# Altium schematic sheet VT_WRP.SchDoc
size A; DocumentNumber: 4; SheetNumber: 4; SheetTotal: 13
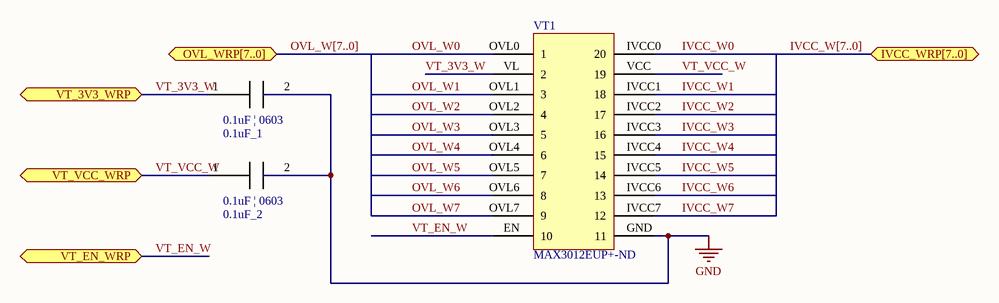
[diagram p0: VT_WRP.SchDoc]

## Parts
0.1uF_1  0.1uF_0603  [0.1uF_0603]  (value not drawn)
0.1uF_2  0.1uF_0603  [0.1uF_0603]  (value not drawn)
VT1  Supplier Part Number 1: MAX3012EUP+-ND  [VT_TSSOP20]  (hidden comment: MAX3012EUP+)

## Ports
IVCC_WRP[7..0], OVL_WRP[7..0], VT_3V3_WRP, VT_EN_WRP, VT_VCC_WRP

## Nets
GND: 0.1uF_1.2 0.1uF_2.2 VT1.GND(11)
IVCC_W0: VT1.IVCC0(20)
IVCC_W1: VT1.IVCC1(18)
IVCC_W2: VT1.IVCC2(17)
IVCC_W3: VT1.IVCC3(16)
IVCC_W4: VT1.IVCC4(15)
IVCC_W5: VT1.IVCC5(14)
IVCC_W6: VT1.IVCC6(13)
IVCC_W7: VT1.IVCC7(12)
OVL_W0: VT1.OVL0(1)
OVL_W1: VT1.OVL1(3)
OVL_W2: VT1.OVL2(4)
OVL_W3: VT1.OVL3(5)
OVL_W4: VT1.OVL4(6)
OVL_W5: VT1.OVL5(7)
OVL_W6: VT1.OVL6(8)
OVL_W7: VT1.OVL7(9)
VT_3V3_W: 0.1uF_1.1 VT1.VL(2) ; port VT_3V3_WRP
VT_EN_W: VT1.EN(10) ; port VT_EN_WRP
VT_VCC_W: 0.1uF_2.1 VT1.VCC(19) ; port VT_VCC_WRP

## Buses and harness runs
bus IVCC_W[7..0] = port IVCC_WRP[7..0]
bus OVL_W[7..0] = port OVL_WRP[7..0]

## Notes on the sheet
- (in symbol 0.1uF_0603) 0.1uF | 0603

## Library data of the parts
VT1 = MAX3012EUP+: IC TRANSLATOR LEVEL 8CH 20-TSSOP; Manufacturer: Maxim Integrated; Translator Type: Voltage Level; Channel Type: Unidirectional; Number of Circuits: 1; Channels per Circuit: 8; Voltage - VCCA: 1.2 V ~ 5.5 V; Voltage - VCCB: 1.65 V ~ 5.5 V; Output Type: Tri-State, Non-Inverted; Data Rate: 35Mbps; Supplier 1: Digi-Key; Manufacturer Part Number: MAX3012EUP+; RoHS: RoHS Compliant; Category: Integrated Circuits (ICs); Stock 1: 297; Pricing 1: 1=3.17, 10=3.012, 25=2.81, 50=2.7668 (USD); Packaging: Tube; Input Signal: -; Output Signal: -; Operating Temperature: -40°C ~ 85°C (TA); Features: Power Supply Decoupling; Mounting Type: Surface Mount; Package / Case: 20-TSSOP (0.173", 4.40mm Width); Supplier Device Package: 20-TSSOP; ComponentLink1URL: http://datasheets.maximintegrated.com/en/ds/MAX3000E-MAX3012.pdf; ComponentLink1Description: http://datasheets.maximintegrated.com/en/ds/MAX3000E-MAX3012.pdf